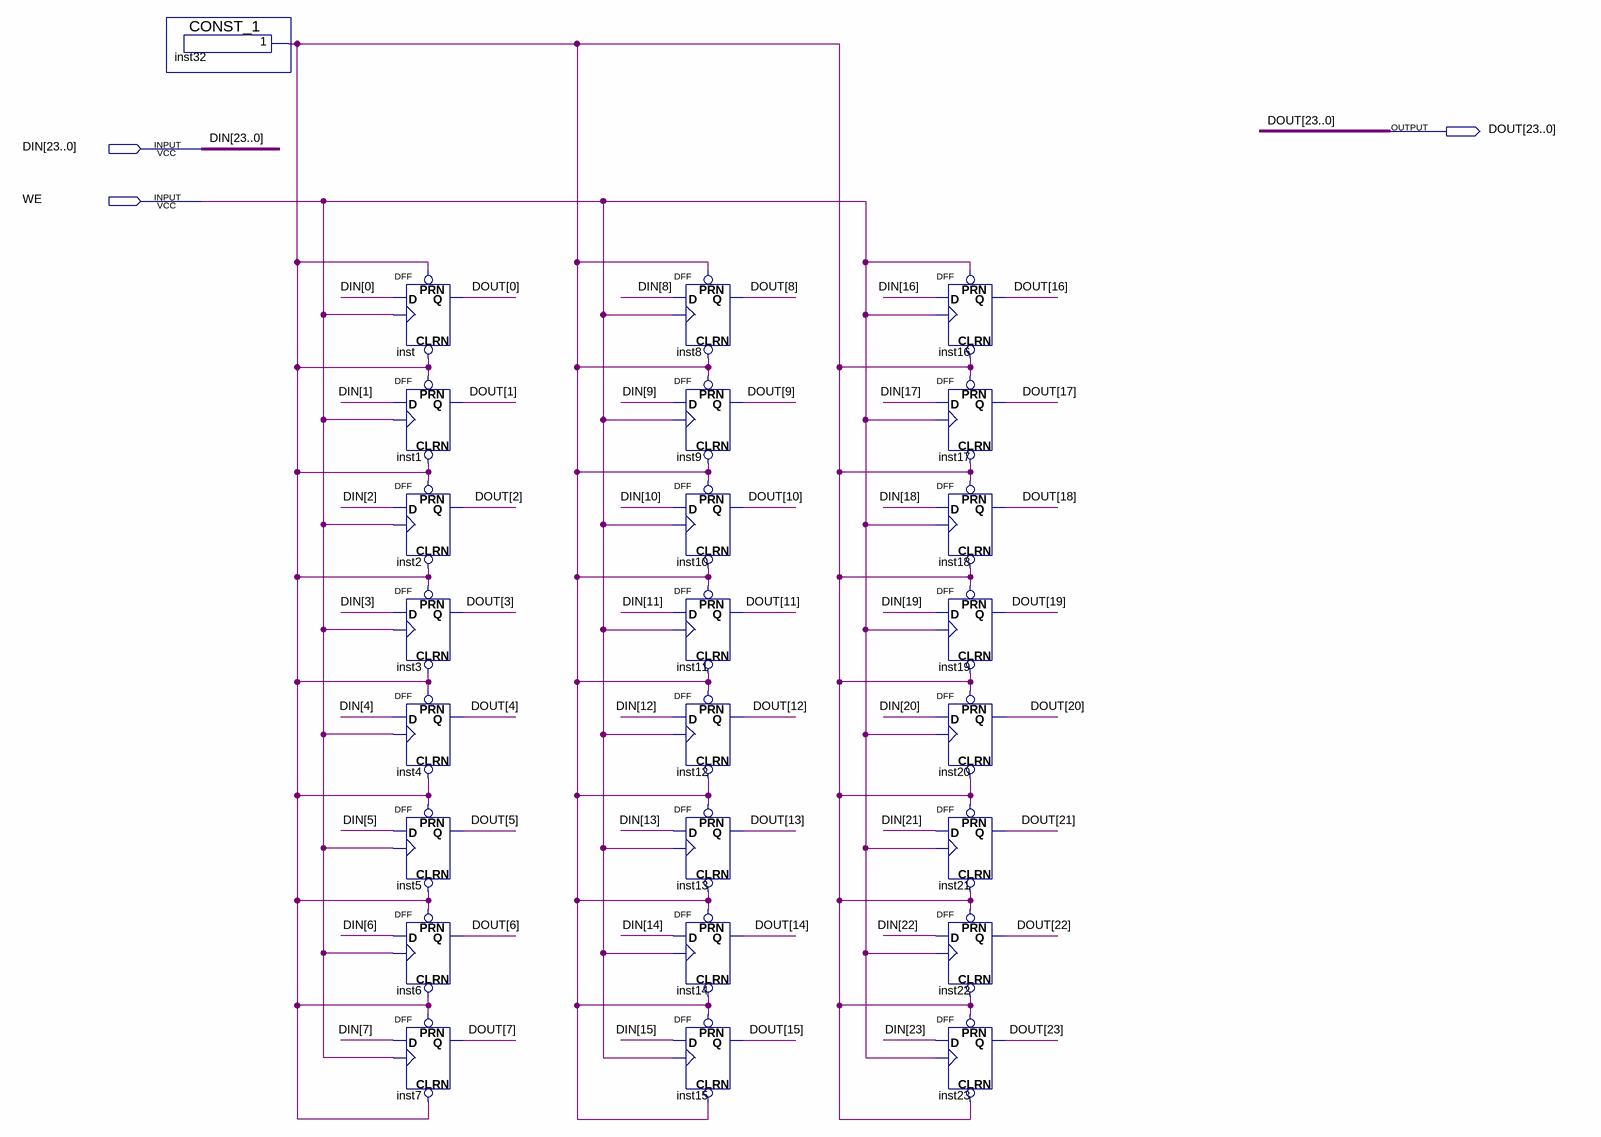
[diagram p0: schematic sheet]
// Quartus schematic REG24.bdf as structural Verilog: 25 symbols, 3 pins
module REG24 (
  input  [23:0] DIN,
  input  WE,
  output [23:0] DOUT
);

  wire inst32_result;

  CONST_1 inst32 (.result(inst32_result));
  DFF inst (.CLRN(inst32_result), .CLK(WE), .D(DIN[0]), .PRN(inst32_result), .Q(DOUT[0]));
  DFF inst1 (.CLRN(inst32_result), .CLK(WE), .D(DIN[1]), .PRN(inst32_result), .Q(DOUT[1]));
  DFF inst2 (.CLRN(inst32_result), .CLK(WE), .D(DIN[2]), .PRN(inst32_result), .Q(DOUT[2]));
  DFF inst3 (.CLRN(inst32_result), .CLK(WE), .D(DIN[3]), .PRN(inst32_result), .Q(DOUT[3]));
  DFF inst4 (.CLRN(inst32_result), .CLK(WE), .D(DIN[4]), .PRN(inst32_result), .Q(DOUT[4]));
  DFF inst5 (.CLRN(inst32_result), .CLK(WE), .D(DIN[5]), .PRN(inst32_result), .Q(DOUT[5]));
  DFF inst6 (.CLRN(inst32_result), .CLK(WE), .D(DIN[6]), .PRN(inst32_result), .Q(DOUT[6]));
  DFF inst7 (.CLRN(inst32_result), .CLK(WE), .D(DIN[7]), .PRN(inst32_result), .Q(DOUT[7]));
  DFF inst8 (.CLRN(inst32_result), .CLK(WE), .D(DIN[8]), .PRN(inst32_result), .Q(DOUT[8]));
  DFF inst9 (.CLRN(inst32_result), .CLK(WE), .D(DIN[9]), .PRN(inst32_result), .Q(DOUT[9]));
  DFF inst10 (.CLRN(inst32_result), .CLK(WE), .D(DIN[10]), .PRN(inst32_result), .Q(DOUT[10]));
  DFF inst11 (.CLRN(inst32_result), .CLK(WE), .D(DIN[11]), .PRN(inst32_result), .Q(DOUT[11]));
  DFF inst12 (.CLRN(inst32_result), .CLK(WE), .D(DIN[12]), .PRN(inst32_result), .Q(DOUT[12]));
  DFF inst13 (.CLRN(inst32_result), .CLK(WE), .D(DIN[13]), .PRN(inst32_result), .Q(DOUT[13]));
  DFF inst14 (.CLRN(inst32_result), .CLK(WE), .D(DIN[14]), .PRN(inst32_result), .Q(DOUT[14]));
  DFF inst15 (.CLRN(inst32_result), .CLK(WE), .D(DIN[15]), .PRN(inst32_result), .Q(DOUT[15]));
  DFF inst16 (.CLRN(inst32_result), .CLK(WE), .D(DIN[16]), .PRN(WE), .Q(DOUT[16]));
  DFF inst17 (.CLRN(inst32_result), .CLK(WE), .D(DIN[17]), .PRN(inst32_result), .Q(DOUT[17]));
  DFF inst18 (.CLRN(inst32_result), .CLK(WE), .D(DIN[18]), .PRN(inst32_result), .Q(DOUT[18]));
  DFF inst19 (.CLRN(inst32_result), .CLK(WE), .D(DIN[19]), .PRN(inst32_result), .Q(DOUT[19]));
  DFF inst20 (.CLRN(inst32_result), .CLK(WE), .D(DIN[20]), .PRN(inst32_result), .Q(DOUT[20]));
  DFF inst21 (.CLRN(inst32_result), .CLK(WE), .D(DIN[21]), .PRN(inst32_result), .Q(DOUT[21]));
  DFF inst22 (.CLRN(inst32_result), .CLK(WE), .D(DIN[22]), .PRN(inst32_result), .Q(DOUT[22]));
  DFF inst23 (.CLRN(inst32_result), .CLK(WE), .D(DIN[23]), .PRN(inst32_result), .Q(DOUT[23]));
endmodule
